# Altium schematic sheet Page_turner_top.SchDoc
size Letter; SheetNumber: 1; SheetTotal: 3
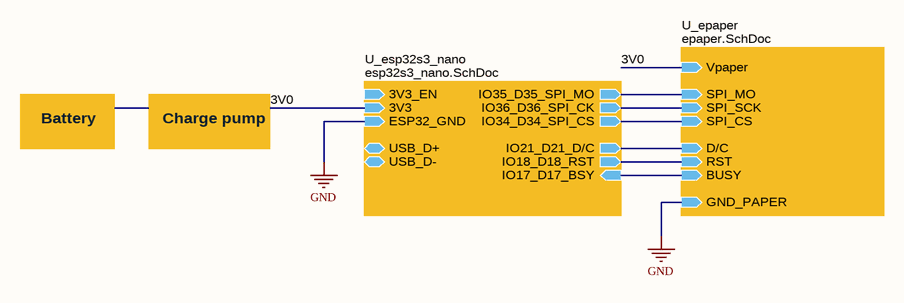
[diagram p0: Page_turner_top.SchDoc]

## Sub-sheets
U_epaper = epaper.SchDoc: Vpaper (in), SPI_MO (in), SPI_SCK (in), SPI_CS (in), GND_PAPER (in), D/C (in), RST (in), BUSY (in)
U_esp32s3_nano = esp32s3_nano.SchDoc: IO35_D35_SPI_MO (out), IO36_D36_SPI_CK (out), IO34_D34_SPI_CS (out), 3V3 (in), USB_D+ (bidir), USB_D- (bidir), 3V3_EN (in), IO21_D21_D/C (out), IO18_D18_RST (out), IO17_D17_BSY (in), ESP32_GND (in)

## Nets
GND: sheet U_epaper/GND_PAPER, sheet U_esp32s3_nano/ESP32_GND
3V0: sheet U_epaper/Vpaper, sheet U_esp32s3_nano/3V3
(unnamed): sheet U_epaper/SPI_MO, sheet U_esp32s3_nano/IO35_D35_SPI_MO
(unnamed): sheet U_epaper/SPI_SCK, sheet U_esp32s3_nano/IO36_D36_SPI_CK
(unnamed): sheet U_epaper/SPI_CS, sheet U_esp32s3_nano/IO34_D34_SPI_CS
(unnamed): sheet U_epaper/D/C, sheet U_esp32s3_nano/IO21_D21_D/C
(unnamed): sheet U_epaper/RST, sheet U_esp32s3_nano/IO18_D18_RST
(unnamed): sheet U_epaper/BUSY, sheet U_esp32s3_nano/IO17_D17_BSY

## Notes on the sheet
- Battery
- Charge pump